# Altium schematic sheet Integrator.SchDoc
size 594 x 420 mm; Address1: Address1; Address2: Address2; Address3: Address3; Address4: Address4; SheetNumber: 1; Scale: 1:1; Разраб.: Иванов; Обозначение документа: АБВГ.123456.001 Э3; Пров.: Петров; Утв.: Сидоров; Наименование организации: ОАО "Концерн "МПО-Гидроприбор"; Перв. применение: АБВГ.123456.000; Наименование изделия 1: Плата; Наименование изделия 2: Схема электрическая; Наименование изделия 3: принципиальная; Нач. отд.: Нач. отд.; Фамилия нач. отд.: Сидоров
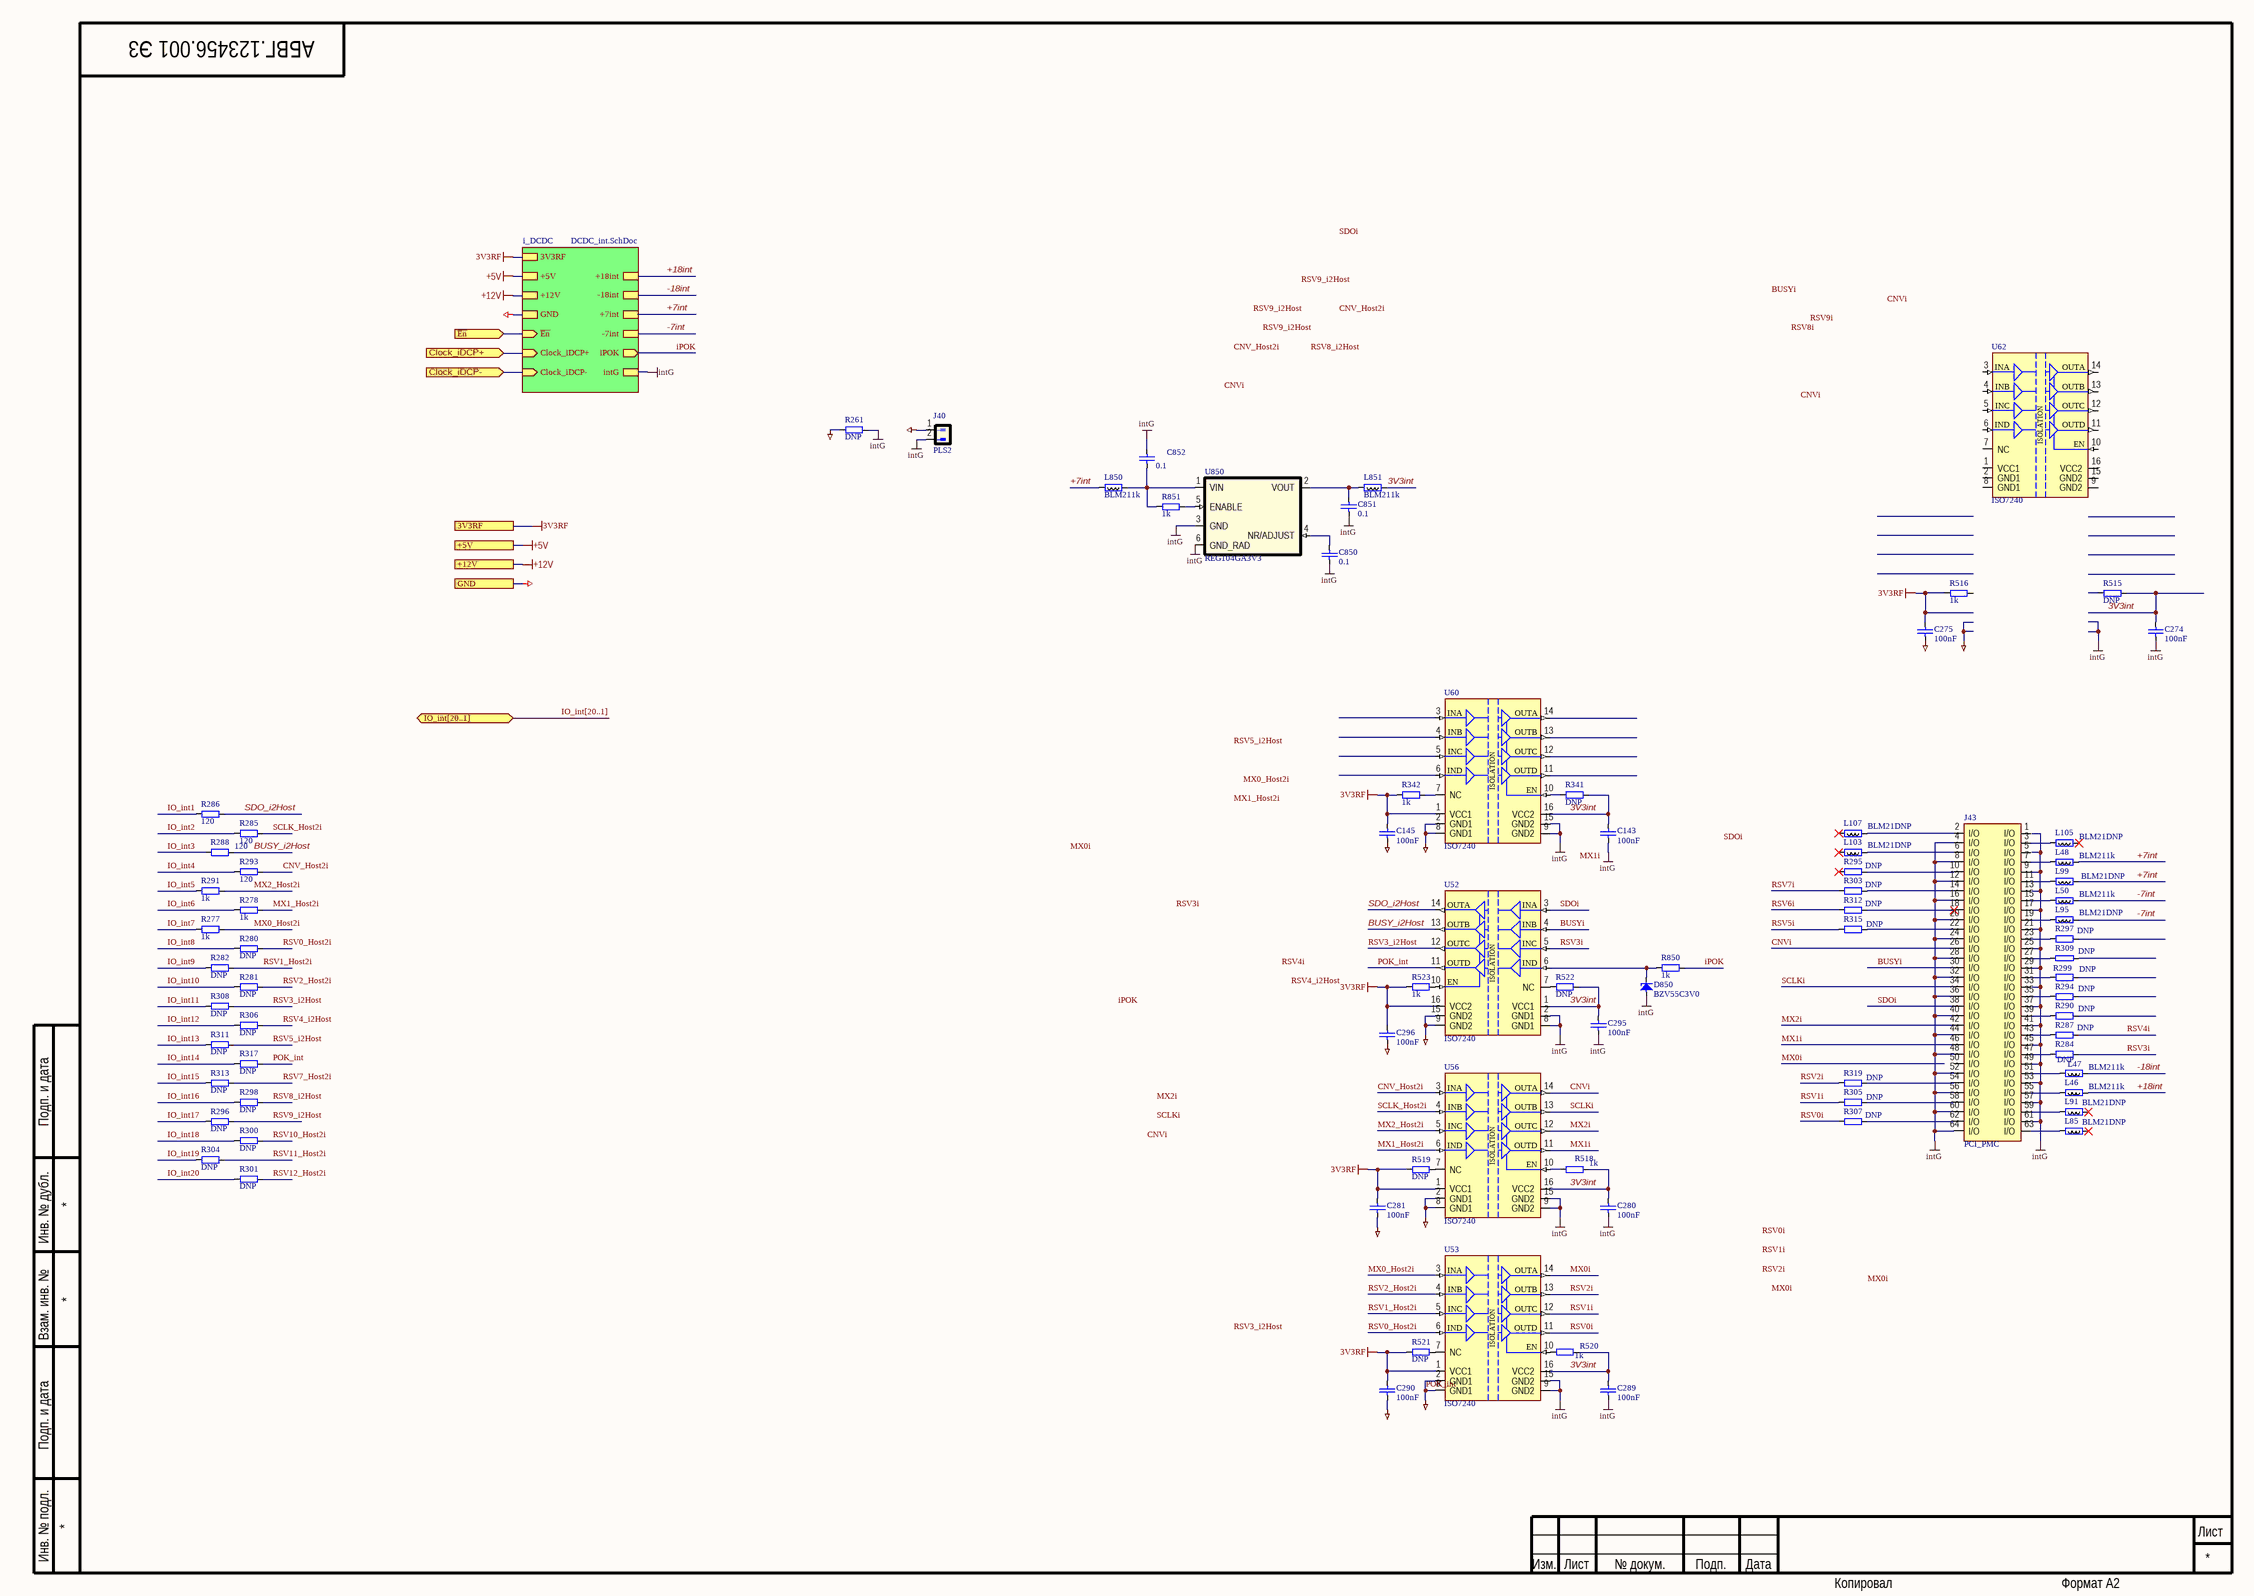
[diagram p0: Integrator.SchDoc]

## Parts
C143  100nF  [SMD0805CAP]
C145  100nF  [SMD0805CAP]
C274  100nF  [SMD0805CAP]
C275  100nF  [SMD0805CAP]
C280  100nF  [SMD0805CAP]
C281  100nF  [SMD0805CAP]
C289  100nF  [SMD0805CAP]
C290  100nF  [SMD0805CAP]
C295  100nF  [SMD0805CAP]
C296  100nF  [SMD0805CAP]
C850  0.1  [SMD0805CAP]
C851  0.1  [SMD0805CAP]
C852  0.1  [SMD0805CAP]
D850  BZV55C3V0  [DIOMELF3516N]
J40  PLS2  [PLS2]
J43  PCI_PMC  [TYCO_120521-1]
L46  BLM211k  [RESC2012X50N]
L47  BLM211k  [RESC2012X50N]
L48  BLM211k  [RESC2012X50N]
L50  BLM211k  [RESC2012X50N]
L85  BLM21DNP  [RESC2012X50N]
L91  BLM21DNP  [RESC2012X50N]
L95  BLM21DNP  [RESC2012X50N]
L99  BLM21DNP  [RESC2012X50N]
L103  BLM21DNP  [RESC2012X50N]
L105  BLM21DNP  [RESC2012X50N]
L107  BLM21DNP  [RESC2012X50N]
L850  BLM211k  [RESC2012X50N]
L851  BLM211k  [RESC2012X50N]
R261  DNP  [SMD0805RES]
R277  1k  [SMD0805RES]
R278  1k  [SMD0805RES]
R280  DNP  [SMD0805RES]
R281  DNP  [SMD0805RES]
R282  DNP  [SMD0805RES]
R284  DNP  [SMD0805RES]
R285  120  [SMD0805RES]
R286  120  [SMD0805RES]
R287  DNP  [SMD0805RES]
R288  120  [SMD0805RES]
R290  DNP  [SMD0805RES]
R291  1k  [SMD0805RES]
R293  120  [SMD0805RES]
R294  DNP  [SMD0805RES]
R295  DNP  [SMD0805RES]
R296  DNP  [SMD0805RES]
R297  DNP  [SMD0805RES]
R298  DNP  [SMD0805RES]
R299  DNP  [SMD0805RES]
R300  DNP  [SMD0805RES]
R301  DNP  [SMD0805RES]
R303  DNP  [SMD0805RES]
R304  DNP  [SMD0805RES]
R305  DNP  [SMD0805RES]
R306  DNP  [SMD0805RES]
R307  DNP  [SMD0805RES]
R308  DNP  [SMD0805RES]
R309  DNP  [SMD0805RES]
R311  DNP  [SMD0805RES]
R312  DNP  [SMD0805RES]
R313  DNP  [SMD0805RES]
R315  DNP  [SMD0805RES]
R317  DNP  [SMD0805RES]
R319  DNP  [SMD0805RES]
R341  DNP  [SMD0805RES]
R342  1k  [SMD0805RES]
R515  DNP  [SMD0805RES]
R516  1k  [SMD0805RES]
R518  1k  [SMD0805RES]
R519  DNP  [SMD0805RES]
R520  1k  [SMD0805RES]
R521  DNP  [SMD0805RES]
R522  DNP  [SMD0805RES]
R523  1k  [SMD0805RES]
R850  1k  [SMD0805RES]
R851  1k  [SMD0805RES]
U52  ISO7240  [SOIC127P1030X265-16N]
U53  ISO7240  [SOIC127P1030X265-16N]
U56  ISO7240  [SOIC127P1030X265-16N]
U60  ISO7240  [SOIC127P1030X265-16N]
U62  ISO7240  [SOIC127P1030X265-16N]
U850  REG104GA3V3  [SOT223_6-127]

## Sub-sheets
i_DCDC = DCDC_int.SchDoc: +18int, -18int, -7int, +7int, ~{En} (in), Clock_iDCP- (in), Clock_iDCP+ (in), +5V, +12V, GND, 3V3RF, intG, iPOK (out)

## Ports
3V3RF, +5V, +12V, Clock_iDCP+ (in), Clock_iDCP- (in), GND, IO_int[20..1] (bidir), ~{En} (in)

## Nets
3V3RF: C145.2 C275.2 C281.2 C290.2 C296.2 R342.1 R516.1 R519.1 R521.1 R523.1 U52.16(VCC2) U53.1(VCC1) U56.1(VCC1) U60.1(VCC1) ; port 3V3RF, sheet i_DCDC/3V3RF
+5V: port +5V, sheet i_DCDC/+5V
+12V: port +12V, sheet i_DCDC/+12V
intG: C143.1 C274.1 C280.1 C289.1 C295.1 C850.2 C851.2 C852.2 D850.2(A) J40.2 J43.4(I/O) J43.8(I/O) J43.12(I/O) J43.16(I/O) J43.20(I/O) J43.24(I/O) J43.28(I/O) J43.32(I/O) J43.36(I/O) J43.40(I/O) J43.44(I/O) J43.48(I/O) J43.52(I/O) J43.56(I/O) J43.60(I/O) J43.64(I/O) R261.2 U52.2(GND1) U52.8(GND1) U53.9(GND2) U53.15(GND2) U56.9(GND2) U56.15(GND2) U60.9(GND2) U60.15(GND2) U850.3(GND) U850.6(GND_RAD) ; sheet i_DCDC/intG
POK_int: C145.1 C275.1 C281.1 C290.1 C296.1 J40.1 R261.1 R317.2 U52.9(GND2) U52.11(OUTD) U52.15(GND2) U53.2(GND1) U53.8(GND1) U56.2(GND1) U56.8(GND1) U60.2(GND1) U60.8(GND1) ; port GND, sheet i_DCDC/GND  [also labelled GND]
3V3int: C143.2 C274.2 C280.2 C289.2 C295.2 L851.2 R341.2 R515.2 R518.2 R520.2 R522.2 U52.1(VCC1) U53.16(VCC2) U56.16(VCC2) U60.16(VCC2)
+7int: L48.2 L99.2 L850.1 ; sheet i_DCDC/+7int
+18int: L46.2 ; sheet i_DCDC/+18int
-7int: L50.2 L95.2 ; sheet i_DCDC/-7int
-18int: L47.2 ; sheet i_DCDC/-18int
~{En}: port ~{En}, sheet i_DCDC/~{En}
BUSY_i2Host: R288.2 U52.13(OUTB)
BUSYi: J43.30(I/O) U52.4(INB)
Clock_iDCP+: port Clock_iDCP+, sheet i_DCDC/Clock_iDCP+
Clock_iDCP-: port Clock_iDCP-, sheet i_DCDC/Clock_iDCP-
CNV_Host2i: R293.2 U56.3(INA)
CNVi: J43.26(I/O) U56.14(OUTA)
IO_int1: R286.1
IO_int2: R285.1
IO_int3: R288.1
IO_int4: R293.1
IO_int5: R291.1
IO_int6: R278.1
IO_int7: R277.1
IO_int8: R280.1
IO_int9: R282.1
IO_int10: R281.1
IO_int11: R308.1
IO_int12: R306.1
IO_int13: R311.1
IO_int14: R317.1
IO_int15: R313.1
IO_int16: R298.1
IO_int17: R296.1
IO_int18: R300.1
IO_int19: R304.1
IO_int20: R301.1
iPOK: R850.2 ; sheet i_DCDC/iPOK
MX0_Host2i: R277.2 U53.3(INA)
MX0i: U53.14(OUTA)
MX1_Host2i: R278.2 U56.6(IND)
MX1i: J43.46(I/O) U56.11(OUTD)
MX2_Host2i: R291.2 U56.5(INC)
MX2i: J43.42(I/O) U56.12(OUTC)
RSV0_Host2i: R280.2 U53.6(IND)
RSV0i: R307.1 U53.11(OUTD)
RSV1_Host2i: R282.2 U53.5(INC)
RSV1i: R305.1 U53.12(OUTC)
RSV2_Host2i: R281.2 U53.4(INB)
RSV2i: R319.1 U53.13(OUTB)
RSV3_i2Host: R308.2 U52.12(OUTC)
RSV3i: R284.2 U52.5(INC)
RSV4_i2Host: R306.2
RSV4i: R287.2
RSV5_i2Host: R311.2
RSV5i: R315.1
RSV6i: R312.1
RSV7_Host2i: R313.2
RSV7i: R303.1
RSV8_i2Host: R298.2
RSV9_i2Host: R296.2
RSV10_Host2i: R300.2
RSV11_Host2i: R304.2
RSV12_Host2i: R301.2
SCLK_Host2i: R285.2 U56.4(INB)
SCLKi: J43.34(I/O) U56.13(OUTB)
SDO_i2Host: R286.2 U52.14(OUTA)
SDOi: J43.38(I/O) U52.3(INA)
NetC850_1: C850.1 U850.4(NR/ADJUST)
NetC851_1: C851.1 L851.1 U850.2(VOUT)
NetC852_1: C852.1 L850.2 R851.1 U850.1(VIN)
NetD850_1: D850.1(C) R850.1 U52.6(IND)
NetJ43_2: J43.2(I/O) L107.2
NetJ43_3: J43.3(I/O) L105.1
NetJ43_6: J43.6(I/O) L103.2
NetJ43_7: J43.7(I/O) L48.1
NetJ43_10: J43.10(I/O) R295.2
NetJ43_11: J43.11(I/O) L99.1
NetJ43_14: J43.14(I/O) R303.2
NetJ43_15: J43.15(I/O) L50.1
NetJ43_18: J43.18(I/O) R312.2
NetJ43_19: J43.19(I/O) L95.1
NetJ43_22: J43.22(I/O) R315.2
NetJ43_23: J43.23(I/O) R297.1
NetJ43_27: J43.27(I/O) R309.2
NetJ43_31: J43.31(I/O) R299.1
NetJ43_35: J43.35(I/O) R294.1
NetJ43_39: J43.39(I/O) R290.1
NetJ43_43: J43.43(I/O) R287.1
NetJ43_47: J43.47(I/O) R284.1
NetJ43_51: J43.51(I/O) L47.1
NetJ43_54: J43.54(I/O) R319.2
NetJ43_55: J43.55(I/O) L46.1
NetJ43_58: J43.58(I/O) R305.2
NetJ43_59: J43.59(I/O) L91.1
NetJ43_62: J43.62(I/O) R307.2
NetJ43_63: J43.63(I/O) L85.1
NetR341_1: R341.1 U60.10(EN)
NetR342_2: R342.2 U60.7(NC)
NetR518_1: R518.1 U56.10(EN)
NetR519_2: R519.2 U56.7(NC)
NetR520_1: R520.1 U53.10(EN)
NetR521_2: R521.2 U53.7(NC)
NetR522_1: R522.1 U52.7(NC)
NetR523_2: R523.2 U52.10(EN)
NetR851_2: R851.2 U850.5(ENABLE)

Not connected (* = marked no-connect by the designer): J43 1(I/O) 5(I/O) 9(I/O) 13(I/O) 17(I/O) 21(I/O) 25(I/O) 29(I/O) 33(I/O) 37(I/O) 41(I/O) 45(I/O) 49(I/O) 50(I/O) 53(I/O) 57(I/O) 61(I/O); L85 2*; L91 2*; L103 1*; L105 2*; L107 1*; R290 2; R294 2; R295 1*; R297 2; R299 2; R309 1; R515 1; R516 2; U60 3(INA) 4(INB) 5(INC) 6(IND) 11(OUTD) 12(OUTC) 13(OUTB) 14(OUTA); U62 1(VCC1) 2(GND1) 3(INA) 4(INB) 5(INC) 6(IND) 7(NC) 8(GND1) 9(GND2) 10(EN) 11(OUTD) 12(OUTC) 13(OUTB) 14(OUTA) 15(GND2) 16(VCC2)

## Buses and harness runs
bus IO_int[20..1] = port IO_int[20..1]

## Notes on the sheet
- Labels drawn without touching a wire or pin: BUSYi, CNV_Host2i, CNVi, iPOK, MX0_Host2i, MX0i, MX1_Host2i, MX1i, MX2i, RSV0i, RSV1i, RSV2i, RSV3_i2Host, RSV3i, RSV4_i2Host, RSV4i, RSV5_i2Host, RSV8_i2Host, RSV8i, RSV9_i2Host, RSV9i, SCLKi, SDOi
- Подп. и дата
- Инв. № дубл.
- Взам. инв. №
- Инв. № подл.
- Изм.
- Лист
- № докум.
- Подп.
- Дата
- Копировал
- Формат А2
- (in symbol ISO7240M) ISOLATION

## Library data of the parts
C143 C145 C274 C275 C280 C281 C289 C290 C295 C296 C850-C852 = C0805: Чип конденсатор 0805; Voltage: 25V; Vendor: Vishay; DielectricType: X5R; SMD Solders: 2; Solder Option: RM; Tolerance: 20%; Pkg: SMD0805; Device: Cap0805; Price: 2
  C143 C145 C274 C275 C280 C281 C289 C290 C295 C296: Value: 100nF
  C850-C852: Value: 0.1
D850 = BZV55C: Чип cтабилитрон; Vendor: LGE; Value: 3V0; Voltage: 3V; SMD Solders: 2; Solder Option: RM; Pkg: SOD80; Current: 5; Price: 5; Device: BZV55C; Name to order: BZV55C3V0
J40 = PLS2: Vendor: Confly; SMD Solders: 0; Solder Option: RM; THD Solders: 2; Price: 1; Device: PLS2
J43 = PCI_PMC_M: PCI Mezzanine Connector; IEEE 1386 MainBoard; Manufactuer: TE Connectivity; PartField: 120527-1; SolderOption: 2; Pkg: PMC Male (IEEE 1386); Value: PCI_PMC; Vendor: TE Connectivity
L46-L48 L50 L850 L851 = BLM21: SMD Ferrite bead 0805; Vendor: Vishay; Value: 1k; Pkg: SMD0805; SMD Solders: 2; Solder Option: RM; Price: 10; Device: BLM21
L85 L91 L95 L99 L103 L105 L107 = BLM21: SMD Ferrite bead 0805; Vendor: Vishay; Value: DNP; Pkg: SMD0805; SMD Solders: 2; Solder Option: RM; Price: 10; Device: BLM21
R261 R341 R515 R519 R521 R522 = R0805: Чип резистор 0805; Vendor: Vishay; SMD Solders: 2; Solder Option: i; TC: 100ppm/C; Tolerance: 1%; Pkg: SMD0805; Pwr: 125mW; Device: Res0805; Price: 2; Value: DNP
R277 R278 R280-R282 R284-R288 R290 R291 R293-R301 R303-R309 R311-R313 R315 R317 R319 R342 R516 R518 R520 R523 R850 R851 = R0805: Чип резистор 0805; Vendor: Vishay; SMD Solders: 2; Solder Option: RM; TC: 100ppm/C; Tolerance: 1%; Pkg: SMD0805; Pwr: 125mW; Device: Res0805; Price: 2
  R277 R278 R291 R342 R516 R518 R520 R523 R850 R851: Value: 1k
  R280-R282 R284 R287 R290 R294-R301 R303-R309 R311-R313 R315 R317 R319: Value: DNP
  R285 R286 R288 R293: Value: 120
U52 U53 U56 U60 U62 = ISO7240M: Двунаправленный буфер; Pkg: SOIC16DW; SMD Solders: 16; Solder Option: RM; THD Solders: 0; Vendor: Texas Instruments; Voltage: 3V3 or 5V; Name to order: ISO7240MDWR; Current: 30; Device: ISO7240; Price: 3500
U850 = REG104GA: Positive LDO Linear stabilizer; Vendor: Texas Instruments; Value: 3V3; SMD Solders: 6; Solder Option: RM; TC: 70ppm/C; Tolerance: +-2% Max; Pkg: SOT223-6; Name to order: REG104GA-A; Vref: 1V295; Price: 1000; Device: REG104GA